# Altium schematic sheet 遥控器1.0.SchDoc
size A4
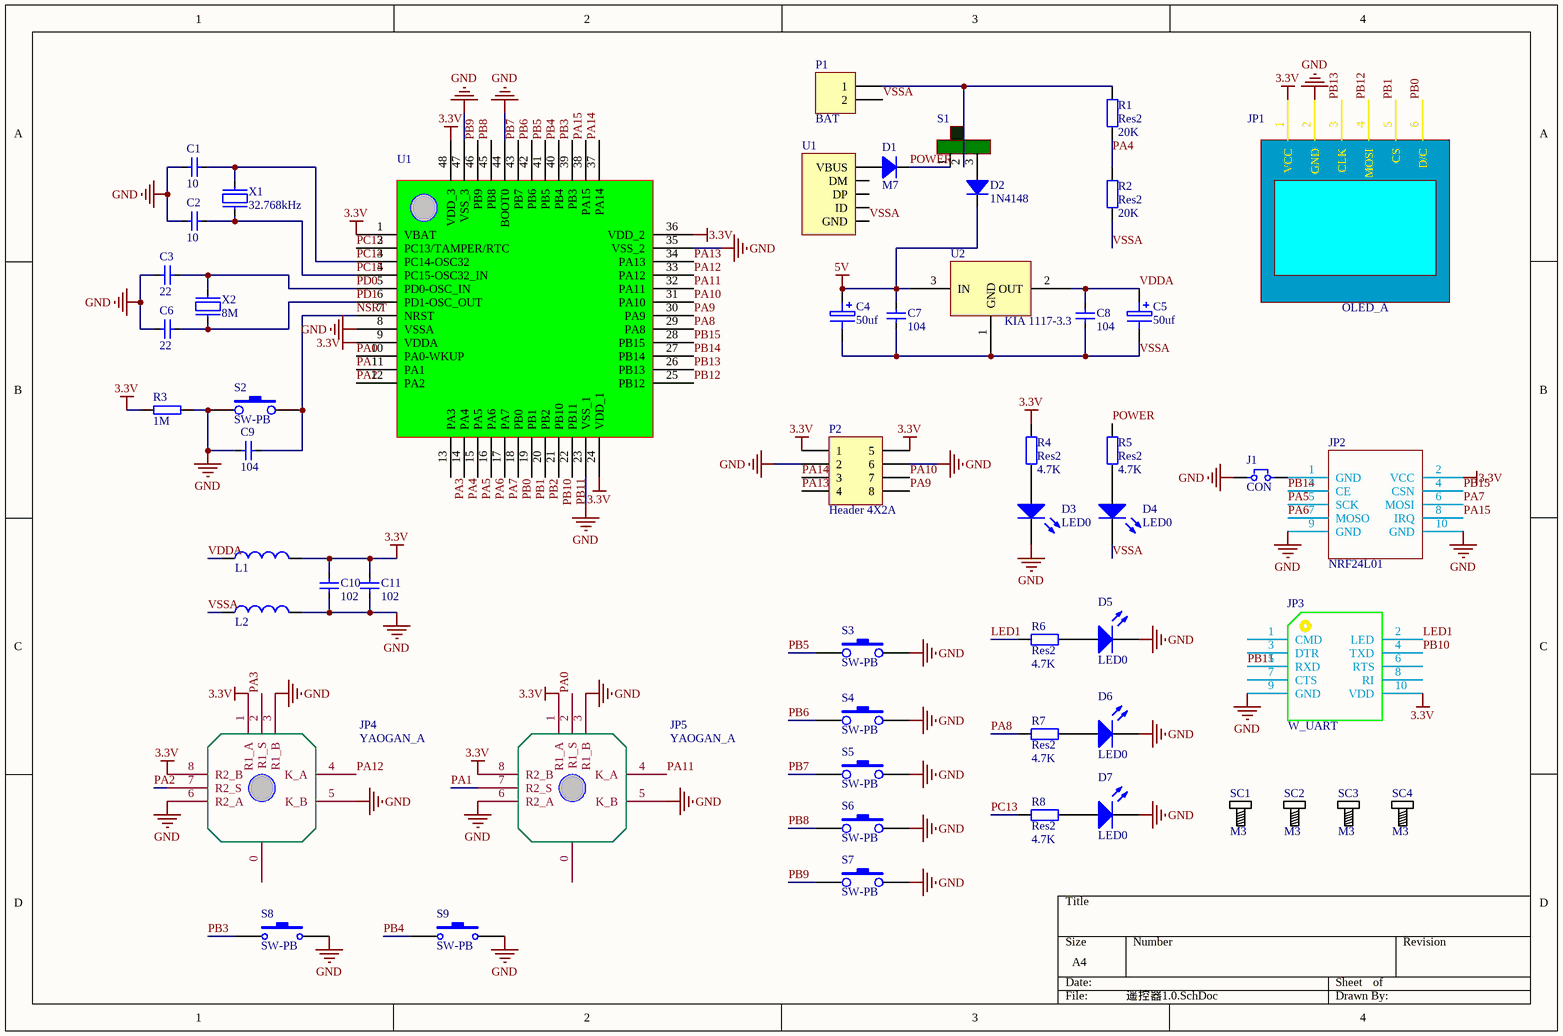
[diagram p0: 遥控器1.0.SchDoc]

## Parts
C1  CAP_22  [0805-C]  (value not drawn)
C2  CAP_22  [0805-C]  (value not drawn)
C3  CAP_22  [0805-C]  (value not drawn)
C4  CAPE_10uf  [CAP_7*7]  (value not drawn)
C5  CAPE_10uf  [CAP_7*7]  (value not drawn)
C6  CAP_22  [0805-C]  (value not drawn)
C7  CAP_22  [0805-C]  (value not drawn)
C8  CAP_22  [0805-C]  (value not drawn)
C9  CAP_22  [0805-C]  (value not drawn)
C10  CAP_22  [0805-C]  (value not drawn)
C11  CAP_22  [0805-C]  (value not drawn)
D1  M7  [D_214A]
D2  1N4148  [D_214A]
D3  LED0  [0805-LED]
D4  LED0  [0805-LED]
D5  LED0  [0805-LED]
D6  LED0  [0805-LED]
D7  LED0  [0805-LED]
J1  CON  [HDR1X2-2.54]
JP1  OLED_A  [OLED-18*17]
JP2  NRF24L01  [NRF24L01_A]
JP3  W_UART  [S-UART]
JP4  YAOGAN_A  [YAOGAN_A]
JP5  YAOGAN_A  [YAOGAN_A]
L1  L_  [0805]  (value not drawn)
L2  L_  [0805]  (value not drawn)
P1  BAT  [3.2X1.6X1.1]
P2  Header 4X2A  [HDR2X4_CEN]
R1  Res2  value 20K  [0805-R]
R2  Res2  value 20K  [0805-R]
R3  RES_10K  [0805-R]  (value not drawn)
R4  Res2  value 4.7K  [0805-R]
R5  Res2  value 4.7K  [0805-R]
R6  Res2  value 4.7K  [0805-R]
R7  Res2  value 4.7K  [0805-R]
R8  Res2  value 4.7K  [0805-R]
S1  SS12D07-1P2T  [SS12D07-1]  (value not drawn)
S2  SW-PB  [SW-SMD-T]
S3  SW-PB  [KEY-SMD]
S4  SW-PB  [KEY-SMD]
S5  SW-PB  [KEY-SMD]
S6  SW-PB  [KEY-SMD]
S7  SW-PB  [KEY-SMD]
S8  SW-PB  [KEY-4B]
S9  SW-PB  [KEY-4B]
SC1  M3  [TZ-M3]
SC2  M3  [TZ-M3]
SC3  M3  [TZ-M3]
SC4  M3  [TZ-M3]
U1  USB_Micro  [USB_MINI_B]  (value not drawn)
U2  KIA 1117-3.3  [SOT-223]
U3  U1  [LQFP48_L]
X1  XTAL  [XO-3*8]  (value not drawn)
X2  XTAL  [HC-49]  (value not drawn)

## Nets
3.3V: C10.2 C11.2 JP1.1(VCC) JP2.2(VCC) JP3.10(VDD) JP4.1(R1_A) JP4.8(R2_B) JP5.1(R1_A) JP5.8(R2_B) L1.2 P2.1 P2.5 R3.2 R4.1 U3.1(VBAT) U3.9(VDDA) U3.24(VDD_1) U3.36(VDD_2) U3.48(VDD_3)
5V: C4.1(+) C7.2 D2.2(K) U2.3(IN)
GND: C1.1 C2.1 C3.1 C6.1 C9.1 C10.1 C11.1 D3.2(K) D5.2(K) D6.2(K) D7.2(K) J1.1 JP1.2(GND) JP2.9(GND) JP2.10(GND) JP3.9(GND) JP4.3(R1_B) JP4.5(K_B) JP4.6(R2_A) JP5.3(R1_B) JP5.5(K_B) JP5.6(R2_A) L2.2 P2.2 P2.6 R3.1 S2.1 S3.2 S4.2 S5.2 S6.2 S7.2 S8.2 S9.2 U3.8(VSSA) U3.23(VSS_1) U3.35(VSS_2) U3.44(BOOT0) U3.47(VSS_3)
LED1: JP3.2(LED) R6.1
NSRT: C9.2 S2.2 U3.7(NRST)
PA0: JP5.2(R1_S) U3.10(PA0-WKUP)
PA1: JP5.7(R2_S) U3.11(PA1)
PA2: JP4.7(R2_S) U3.12(PA2)
PA3: JP4.2(R1_S) U3.13(PA3)
PA4: R1.1 R2.2 U3.14(PA4)
PA5: JP2.5(SCK) U3.15(PA5)
PA6: JP2.7(MOSO) U3.16(PA6)
PA7: JP2.6(MOSI) U3.17(PA7)
PA8: R7.1 U3.29(PA8)
PA9: P2.8 U3.30(PA9)
PA10: P2.7 U3.31(PA10)
PA11: JP5.4(K_A) U3.32(PA11)
PA12: JP4.4(K_A) U3.33(PA12)
PA13: P2.4 U3.34(PA13)
PA14: P2.3 U3.37(PA14)
PA15: JP2.8(IRQ) U3.38(PA15)
PB0: JP1.6(D/C) U3.18(PB0)
PB1: JP1.5(CS) U3.19(PB1)
PB2: U3.20(PB2)
PB3: S8.1 U3.39(PB3)
PB4: S9.1 U3.40(PB4)
PB5: S3.1 U3.41(PB5)
PB6: S4.1 U3.42(PB6)
PB7: S5.1 U3.43(PB7)
PB8: S6.1 U3.45(PB8)
PB9: S7.1 U3.46(PB9)
PB10: JP3.4(TXD) U3.21(PB10)
PB11: JP3.5(RXD) U3.22(PB11)
PB12: JP1.4(MOSI) U3.25(PB12)
PB13: JP1.3(CLK) U3.26(PB13)
PB14: JP2.3(CE) U3.27(PB14)
PB15: JP2.4(CSN) U3.28(PB15)
PC13: R8.1 U3.2(PC13/TAMPER/RTC)
PC14: C1.2 U3.3(PC14-OSC32) X1.2
PC15: C2.2 U3.4(PC15-OSC32_IN) X1.1
PD0: C3.2 U3.5(PD0-OSC_IN) X2.2
PD1: C6.2 U3.6(PD1-OSC_OUT) X2.1
POWER: D1.2(K) R5.1 S1.1(S1)
VDDA: C5.1(+) C8.2 L1.1 U2.2(OUT)
VSSA: C4.2(--) C5.2(--) C7.1 C8.1 D4.2(K) L2.1 P1.2 R2.1 U1.5(GND) U2.1(GND)
NetD1_1: D1.1(A) U1.1(VBUS)
NetD2_1: D2.1(A) S1.3(S3)
NetD3_1: D3.1(A) R4.2
NetD4_1: D4.1(A) R5.2
NetD5_1: D5.1(A) R6.2
NetD6_1: D6.1(A) R7.2
NetD7_1: D7.1(A) R8.2
NetJ1_2: J1.2 JP2.1(GND)
NetP1_1: P1.1 R1.2 S1.2(S2)

Not connected (* = marked no-connect by the designer): JP3 1(CMD) 3(DTR) 6(RTS) 7(CTS) 8(RI); JP4 0; JP5 0; U1 2(DM) 3(DP) 4(ID)

## Notes on the sheet
- (in symbol CAP_22) 22; 104; 10; 102
- (in symbol CAPE_10uf) 50uf
- (in symbol RES_10K) 1M
- (in symbol XTAL) 8M; 32.768kHz

## Library data of the parts
D1 = 1N4148: Value: 1N4148
D3-D7 = LED0: Typical INFRARED GaAs LED; Published: 8-Jun-2000; LatestRevisionDate: 08-Jul-2005; LatestRevisionNote: Mech Layer 1 removed.; PackageReference: LED-0; Publisher: Altium Limited; PackageDescription: LED; 2 Leads
J1 = JAP-HEADER2
P1 = Header 2: Header, 2-Pin; LatestRevisionDate: 17-Jul-2002; LatestRevisionNote: Re-released for DXP Platform.; Publisher: Altium Limited
P2 = Header 4X2A: Header, 4-Pin, Dual row; LatestRevisionDate: 17-Jul-2002; LatestRevisionNote: Re-released for DXP Platform.; Publisher: Altium Limited
R1 R2 R4-R8 = Res2: Resistor; Published: 8-Jun-2000; LatestRevisionDate: 17-Jul-2002; LatestRevisionNote: Re-released for DXP Platform.; PackageReference: AXIAL-0.4; Publisher: Altium Limited; PackageDescription: Axial Device, Thru-Hole; 2 Leads; 0.4 in Pin Spacing
S1 = SS12D07
S8 S9 = SW-PB: Switch; Published: 24-Mar-1999; LatestRevisionDate: 17-Jul-2002; LatestRevisionNote: Re-released for DXP Platform.; PackageReference: SPST-2; Publisher: Altium Limited; PackageDescription: Switch; 2 Leads
SC1-SC4 = Screw_M3: Screw
U1 = USB_Micro: USB
U3 = Component_1: STM32F103C8T6
D2 = 1N4148: Value: 1N4148